# EAGLE design mainv5 (EAGLE 9.2.0)
Custom Smart 12V Battery control system.
CNAME: Caravan 12V Control System; CREVISION: 4.0; DESIGNER: Tim McConnell, M0THM

## Sheet 1 of 2
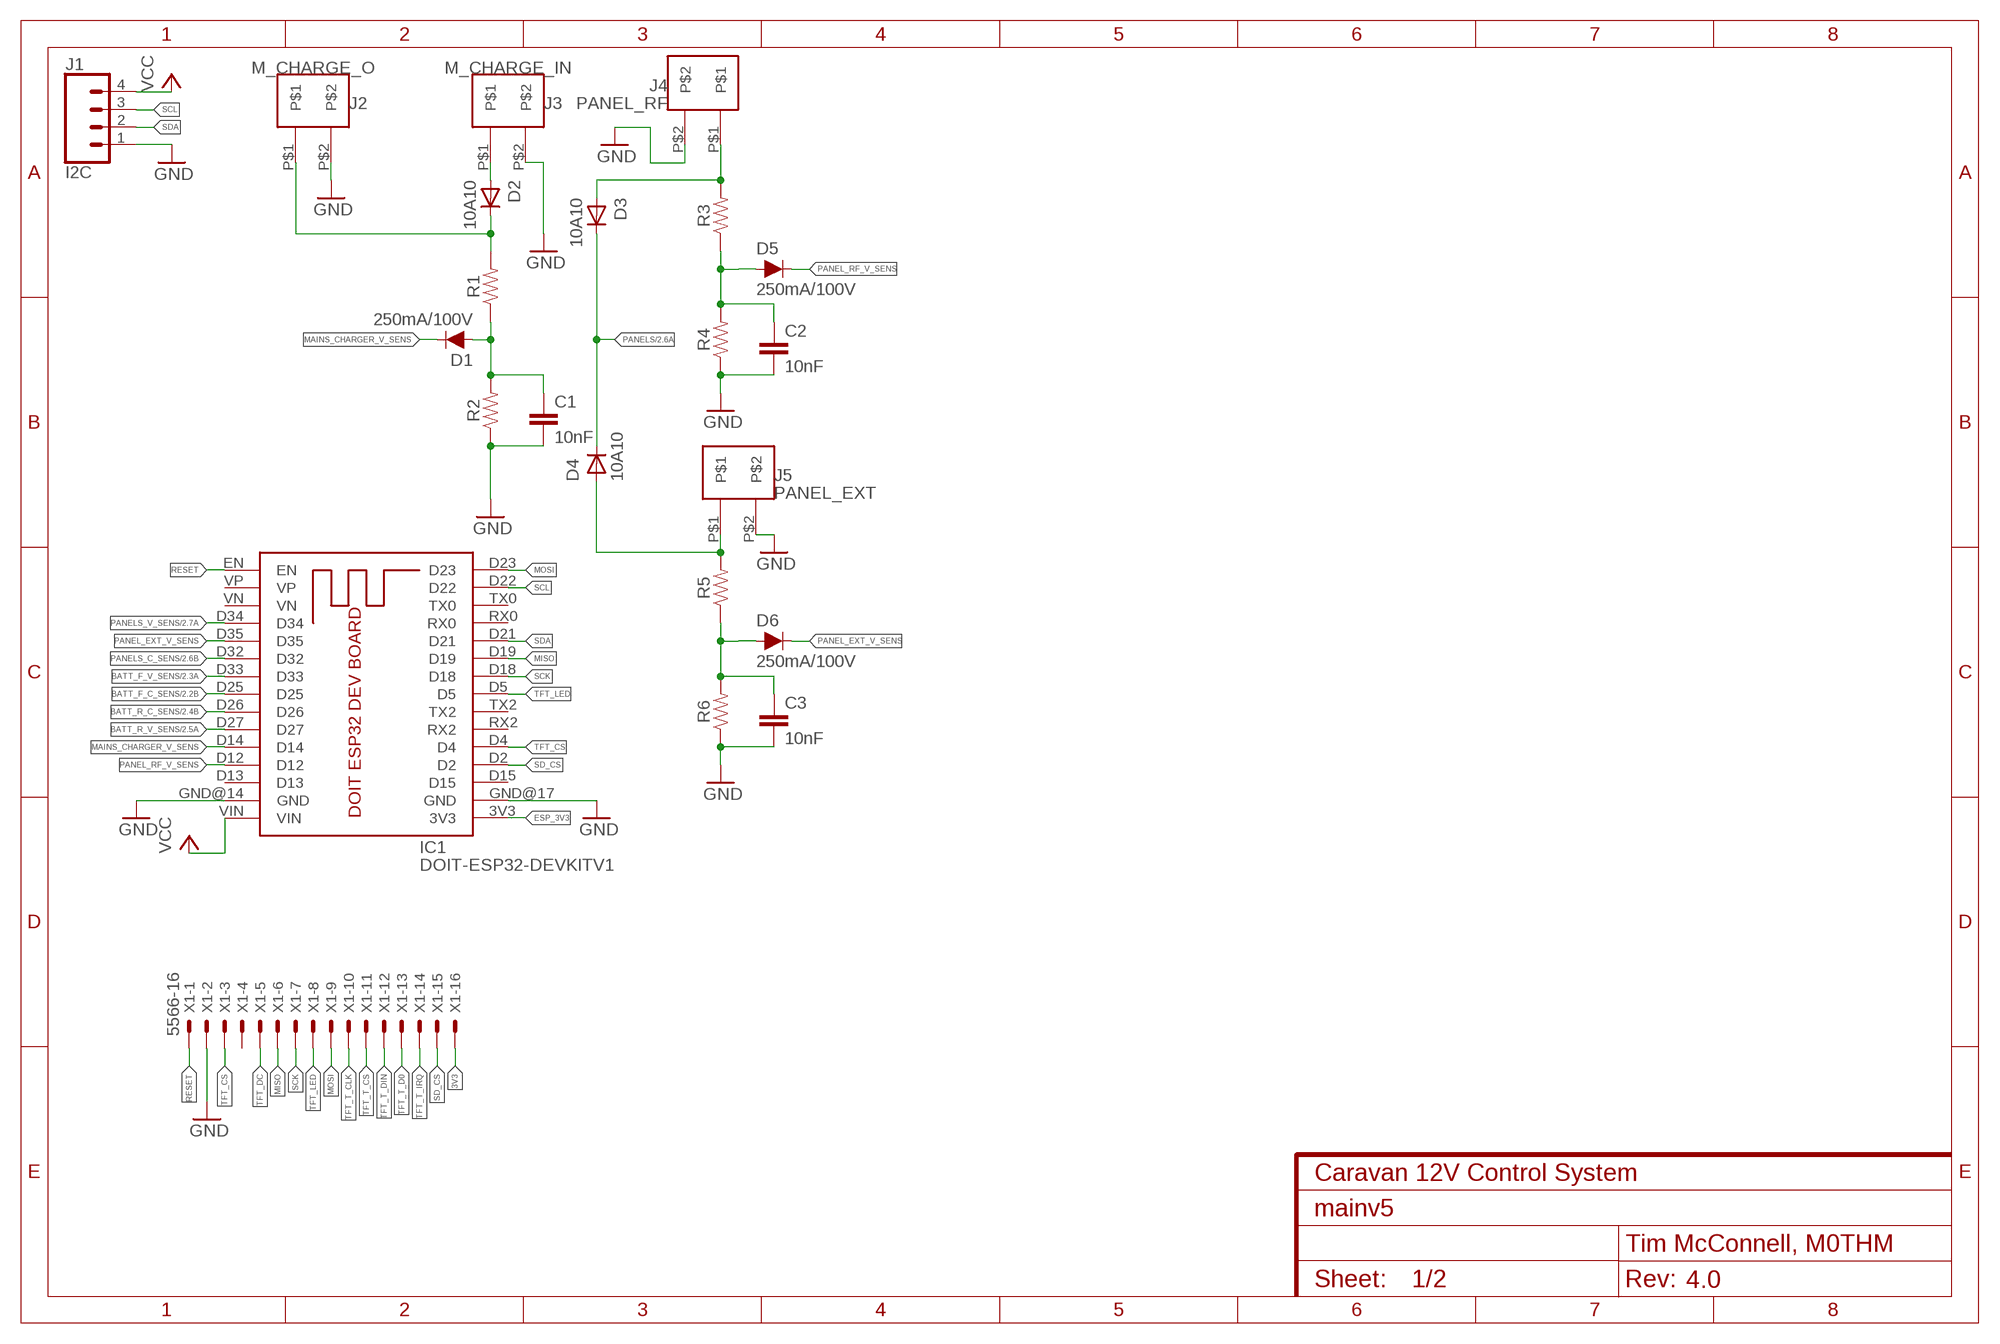
[diagram p0: schematic, sheet 1]

### Parts
C1  10nF  10NF-0603-50V-10%  [0603]
C2  10nF  10NF-0603-50V-10%  [0603]
C3  10nF  10NF-0603-50V-10%  [0603]
D1  250mA/100V  DIODE-BAS16J  [SOD-323]
D2  10A10  [AG]
D3  10A10  [AG]
D4  10A10  [AG]
D5  250mA/100V  DIODE-BAS16J  [SOD-323]
D6  250mA/100V  DIODE-BAS16J  [SOD-323]
IC1  DOIT-ESP32-DEVKITV1  [DOIT-ESP32-DEVKITV1]
J1  I2C  CONN_04POLAR  [MOLEX-1X4]
J2  M_CHARGE_O  40A-2PIN  [40A-2PIN]
J3  M_CHARGE_IN  40A-2PIN  [40A-2PIN]
J4  PANEL_RF  40A-2PIN  [40A-2PIN]
J5  PANEL_EXT  40A-2PIN  [40A-2PIN]
R1  RESISTOR0805  [0805]
R2  RESISTOR0805  [0805]
R3  RESISTOR0805  [0805]
R4  RESISTOR0805  [0805]
R5  RESISTOR0805  [0805]
R6  RESISTOR0805  [0805]
X1  5566-16  [5566-16]

### Nets
3V3: X1.16
BATT_F_C_SENS: IC1.D25 ; also sheet 2
BATT_F_V_SENS: IC1.D33 ; also sheet 2
BATT_R_C_SENS: IC1.D26 ; also sheet 2
BATT_R_V_SENS: IC1.D27 ; also sheet 2
ESP_3V3: IC1.3V3
GND: C1.2 C2.2 C3.2 IC1.GND@14(GND) IC1.GND@17(GND) J1.1 J2.P$2 J3.P$2 J4.P$2 J5.P$2 R2.1 R4.1 R6.1 X1.2 ; also sheet 2
MAINS_CHARGER_V_SENS: D1.C IC1.D14
MISO: IC1.D19 X1.6
MOSI: IC1.D23 X1.9
N$1: D2.A J3.P$1
N$2: D2.C J2.P$1 R1.2
N$13: D3.A J4.P$1 R3.2
N$14: C2.1 D5.A R3.1 R4.2
N$15: C3.1 D6.A R5.1 R6.2
N$16: D4.A J5.P$1 R5.2
N$17: C1.1 D1.A R1.1 R2.2
PANEL_EXT_V_SENS: D6.C IC1.D35
PANEL_RF_V_SENS: D5.C IC1.D12
PANELS: D3.C D4.C ; also sheet 2
PANELS_C_SENS: IC1.D32 ; also sheet 2
PANELS_V_SENS: IC1.D34 ; also sheet 2
RESET: IC1.EN X1.1
SCK: IC1.D18 X1.7
SCL: IC1.D22 J1.3
SD_CS: IC1.D2 X1.15
SDA: IC1.D21 J1.2
TFT_CS: IC1.D4 X1.3
TFT_DC: X1.5
TFT_LED: IC1.D5 X1.8
TFT_T_CLK: X1.10
TFT_T_CS: X1.11
TFT_T_D0: X1.13
TFT_T_DIN: X1.12
TFT_T_IRQ: X1.14
VCC: IC1.VIN J1.4 ; also sheet 2
Unconnected: IC1.D13 IC1.D15 IC1.RX0 IC1.RX2 IC1.TX0 IC1.TX2 IC1.VN IC1.VP X1.4

## Sheet 2 of 2
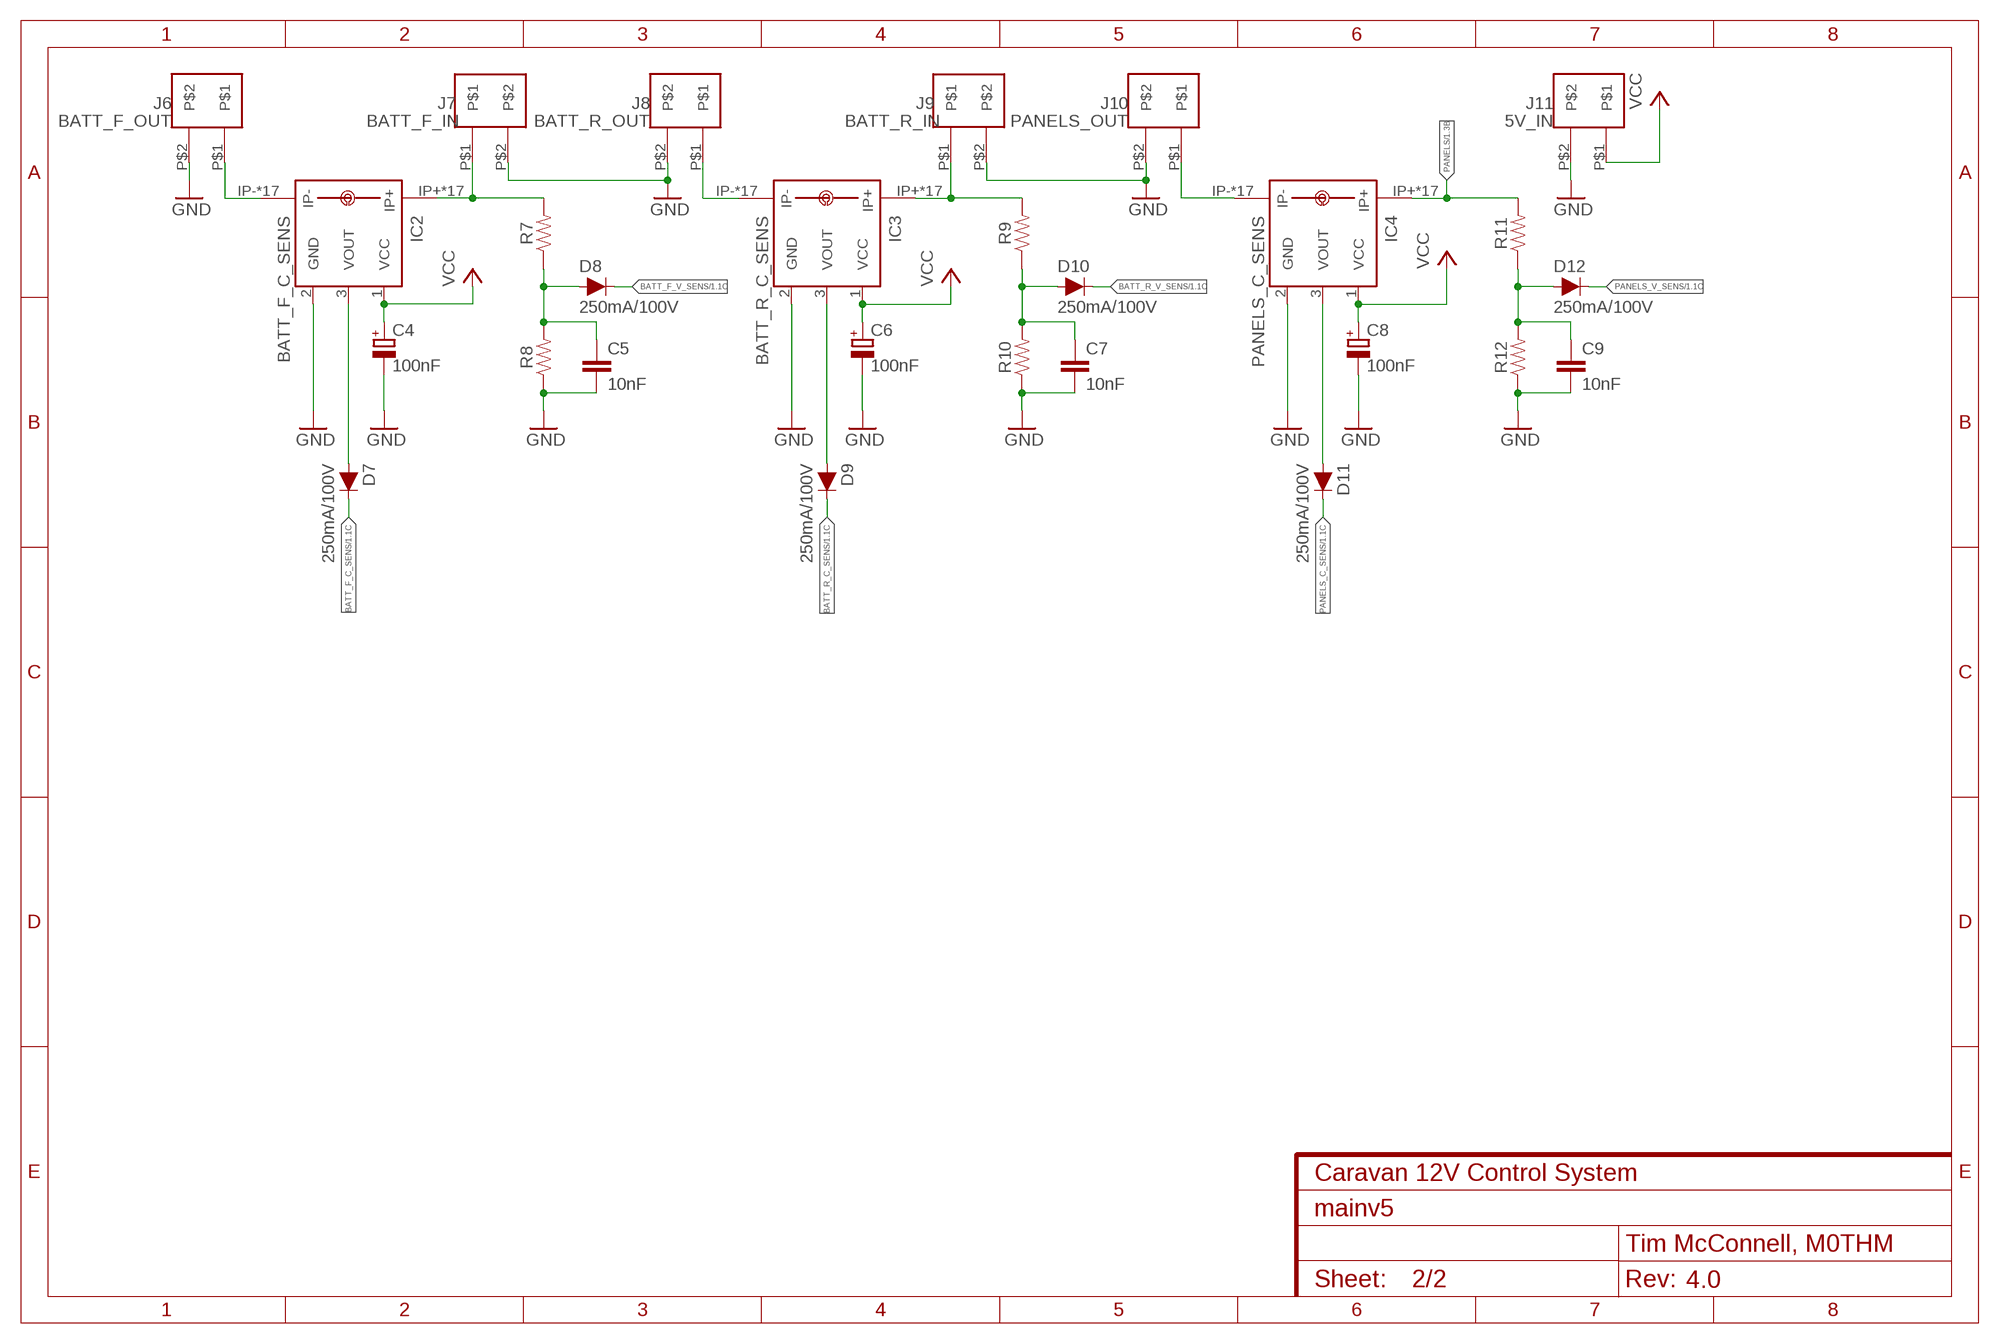
[diagram p1: schematic, sheet 2]

### Parts
C4  100nF  CPOL-EUE  [PANASONIC_E]
C5  10nF  10NF-0603-50V-10%  [0603]
C6  100nF  CPOL-EUE  [PANASONIC_E]
C7  10nF  10NF-0603-50V-10%  [0603]
C8  100nF  CPOL-EUE  [PANASONIC_E]
C9  10nF  10NF-0603-50V-10%  [0603]
D7  250mA/100V  DIODE-BAS16J  [SOD-323]
D8  250mA/100V  DIODE-BAS16J  [SOD-323]
D9  250mA/100V  DIODE-BAS16J  [SOD-323]
D10  250mA/100V  DIODE-BAS16J  [SOD-323]
D11  250mA/100V  DIODE-BAS16J  [SOD-323]
D12  250mA/100V  DIODE-BAS16J  [SOD-323]
IC2  BATT_F_C_SENS  ACS758ECB-200B-PFF-T  [CB-PFF]
IC3  BATT_R_C_SENS  ACS758ECB-200B-PFF-T  [CB-PFF]
IC4  PANELS_C_SENS  ACS758ECB-200B-PFF-T  [CB-PFF]
J6  BATT_F_OUT  40A-2PIN  [40A-2PIN]
J7  BATT_F_IN  40A-2PIN  [40A-2PIN]
J8  BATT_R_OUT  40A-2PIN  [40A-2PIN]
J9  BATT_R_IN  40A-2PIN  [40A-2PIN]
J10  PANELS_OUT  40A-2PIN  [40A-2PIN]
J11  5V_IN  40A-2PIN  [40A-2PIN]
R7  RESISTOR0805  [0805]
R8  RESISTOR0805  [0805]
R9  RESISTOR0805  [0805]
R10  RESISTOR0805  [0805]
R11  RESISTOR0805  [0805]
R12  RESISTOR0805  [0805]

### Nets
BATT_F_C_SENS: D7.C ; also sheet 1
BATT_F_V_SENS: D8.C ; also sheet 1
BATT_R_C_SENS: D9.C ; also sheet 1
BATT_R_V_SENS: D10.C ; also sheet 1
GND: C4.- C5.2 C6.- C7.2 C8.- C9.2 IC2.2(GND) IC3.2(GND) IC4.2(GND) J6.P$2 J7.P$2 J8.P$2 J9.P$2 J10.P$2 J11.P$2 R8.1 R10.1 R12.1 ; also sheet 1
N$3: IC2.IP- IC2.IP-@2(IP-) IC2.IP-@3(IP-) IC2.IP-@4(IP-) IC2.IP-@5(IP-) IC2.IP-@6(IP-) IC2.IP-@7(IP-) IC2.IP-@8(IP-) IC2.IP-@9(IP-) IC2.IP-@10(IP-) IC2.IP-@11(IP-) IC2.IP-@12(IP-) IC2.IP-@13(IP-) IC2.IP-@14(IP-) IC2.IP-@15(IP-) IC2.IP-@16(IP-) IC2.IP-@17(IP-) J6.P$1
N$11: D7.A IC2.3(VOUT)
N$20: IC2.IP+ IC2.IP+@2(IP+) IC2.IP+@3(IP+) IC2.IP+@4(IP+) IC2.IP+@5(IP+) IC2.IP+@6(IP+) IC2.IP+@7(IP+) IC2.IP+@8(IP+) IC2.IP+@9(IP+) IC2.IP+@10(IP+) IC2.IP+@11(IP+) IC2.IP+@12(IP+) IC2.IP+@13(IP+) IC2.IP+@14(IP+) IC2.IP+@15(IP+) IC2.IP+@16(IP+) IC2.IP+@17(IP+) J7.P$1 R7.2
N$21: C5.1 D8.A R7.1 R8.2
N$22: D9.A IC3.3(VOUT)
N$23: IC3.IP- IC3.IP-@2(IP-) IC3.IP-@3(IP-) IC3.IP-@4(IP-) IC3.IP-@5(IP-) IC3.IP-@6(IP-) IC3.IP-@7(IP-) IC3.IP-@8(IP-) IC3.IP-@9(IP-) IC3.IP-@10(IP-) IC3.IP-@11(IP-) IC3.IP-@12(IP-) IC3.IP-@13(IP-) IC3.IP-@14(IP-) IC3.IP-@15(IP-) IC3.IP-@16(IP-) IC3.IP-@17(IP-) J8.P$1
N$24: IC3.IP+ IC3.IP+@2(IP+) IC3.IP+@3(IP+) IC3.IP+@4(IP+) IC3.IP+@5(IP+) IC3.IP+@6(IP+) IC3.IP+@7(IP+) IC3.IP+@8(IP+) IC3.IP+@9(IP+) IC3.IP+@10(IP+) IC3.IP+@11(IP+) IC3.IP+@12(IP+) IC3.IP+@13(IP+) IC3.IP+@14(IP+) IC3.IP+@15(IP+) IC3.IP+@16(IP+) IC3.IP+@17(IP+) J9.P$1 R9.2
N$25: C7.1 D10.A R9.1 R10.2
N$26: D11.A IC4.3(VOUT)
N$27: IC4.IP- IC4.IP-@2(IP-) IC4.IP-@3(IP-) IC4.IP-@4(IP-) IC4.IP-@5(IP-) IC4.IP-@6(IP-) IC4.IP-@7(IP-) IC4.IP-@8(IP-) IC4.IP-@9(IP-) IC4.IP-@10(IP-) IC4.IP-@11(IP-) IC4.IP-@12(IP-) IC4.IP-@13(IP-) IC4.IP-@14(IP-) IC4.IP-@15(IP-) IC4.IP-@16(IP-) IC4.IP-@17(IP-) J10.P$1
N$28: C9.1 D12.A R11.1 R12.2
PANELS: IC4.IP+ IC4.IP+@2(IP+) IC4.IP+@3(IP+) IC4.IP+@4(IP+) IC4.IP+@5(IP+) IC4.IP+@6(IP+) IC4.IP+@7(IP+) IC4.IP+@8(IP+) IC4.IP+@9(IP+) IC4.IP+@10(IP+) IC4.IP+@11(IP+) IC4.IP+@12(IP+) IC4.IP+@13(IP+) IC4.IP+@14(IP+) IC4.IP+@15(IP+) IC4.IP+@16(IP+) IC4.IP+@17(IP+) R11.2 ; also sheet 1
PANELS_C_SENS: D11.C ; also sheet 1
PANELS_V_SENS: D12.C ; also sheet 1
VCC: C4.+ C6.+ C8.+ IC2.1(VCC) IC3.1(VCC) IC4.1(VCC) J11.P$1 ; also sheet 1

## Library data of the parts
C1-C3 C5 C7 C9 = SparkFun-Capacitors:10NF: 0.01uF/10nF/10,000pF ceramic capacitors A capacitor is a passive two-terminal electrical component used to store electrical energy temporarily in an electric field. CAP-09321; PROD_ID: CAP-00867
C4 C6 C8 = rcl:CPOL-EU: POLARIZED CAPACITOR, European symbol; SPICEPREFIX: C
D1 D5-D12 = SparkFun-DiscreteSemi:DIODE: Diode These are standard reverse protection diodes and small signal diodes. SparkFun Products: SparkFun SparkPunk Sound Kit <https://www.sparkfun.com/products/11177> SparkFun ESP8266 Thing <https://www.sparkfun.com/products/13231>; PROD_ID: DIO-09646
D2-D4 = m0thm:10A10
IC1 = m0thm:DOIT-ESP32-DEVKITV1: https://docs.zerynth.com/latest/official/board.zerynth.doit_esp32/docs/index.html
IC2-IC4 = allegro-2:ACS758*: Thermally Enhanced, Fully Integrated, Hall Effect-Based Linear Current Sensor with 100 micro Ohm Current Conductor display layer 49 Reference in BRD and place VIAs on circles Source: http://www.allegromicro.com/en/Products/Part_Numbers/0758/0758.pdf; MPN: ACS758ECB-200B-PFF-T; OC_FARNELL: 1718993; OC_NEWARK: 04R7127
J1 = SparkFun-Connectors:CONN_04: Multi connection point. Often used as Generic Header-pin footprint for 0.1 inch spaced/style header connections On any of the 0.1 inch spaced packages, you can populate with these: Break Away Headers - Straight <https://www.sparkfun.com/products/116> (PRT-00116) Break Away Male Headers - Right Angle <https://www.sparkfun.com/products/553> (PRT-00553) Female Headers <https://www.sparkfun.com/products/115> (PRT-00115) Break Away Headers - Machine Pin <https://www.sparkfun.com/products/117> (PRT-00117) Break Away Female Headers - Swiss Machine Pin <https://www.sparkfun.com/products/743> (PRT-00743) For SCREWTERMINALS and SPRING TERMINALS visit here: Screw Terimnals on SparkFun.com <https://www.sparkfun.com/search/results?term=Screw+Terminals> (5mm/3.5mm/2.54mm spacing) This device is also useful as a general connection point to wire up your design to another part of your project. Our various solder wires solder well into these plated through hole pads. Hook-Up Wire - Assortment (Stranded, 22 AWG) <https://www.sparkfun.com/products/11375> (PRT-11375) Hook-Up Wire - Assortment (Solid Core, 22 AWG) <https://www.sparkfun.com/products/11367> (PRT-11367) View the entire wire category on our website here <https://www.sparkfun.com/categories/141> Special notes: Molex polarized connector foot print use with SKU : PRT-08231 with associated crimp pins and housings. 1MM SMD Version SKU: PRT-10208; PROD_ID: CONN-08186; SF_ID: PRT-08231
J2-J11 = m0thm:40A-2PIN
R1-R12 = SparkFun-Resistors:RESISTOR: Generic Resistor Package
X1 = con-molex:5566-16: Mini FIT connector 16 pol Source: http://www.molex.com; MF: MOLEX; OC_FARNELL: unknown; OC_NEWARK: unknown

## Board
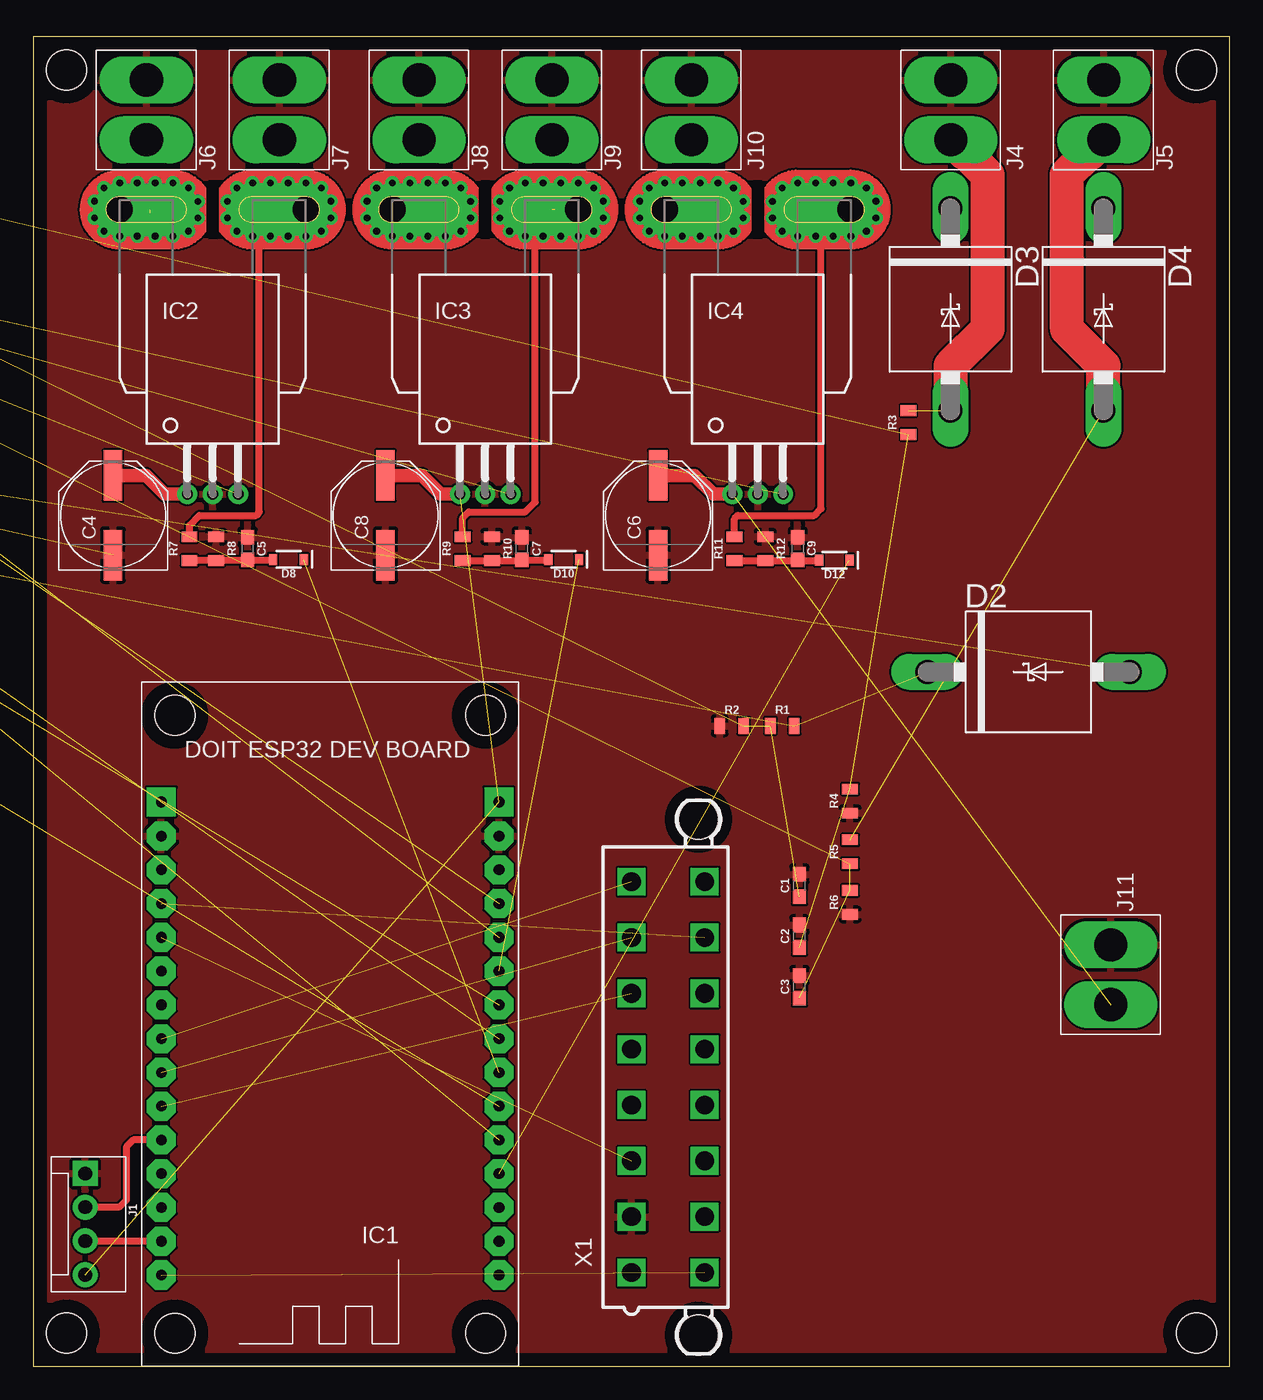
[diagram p2: board, top side]
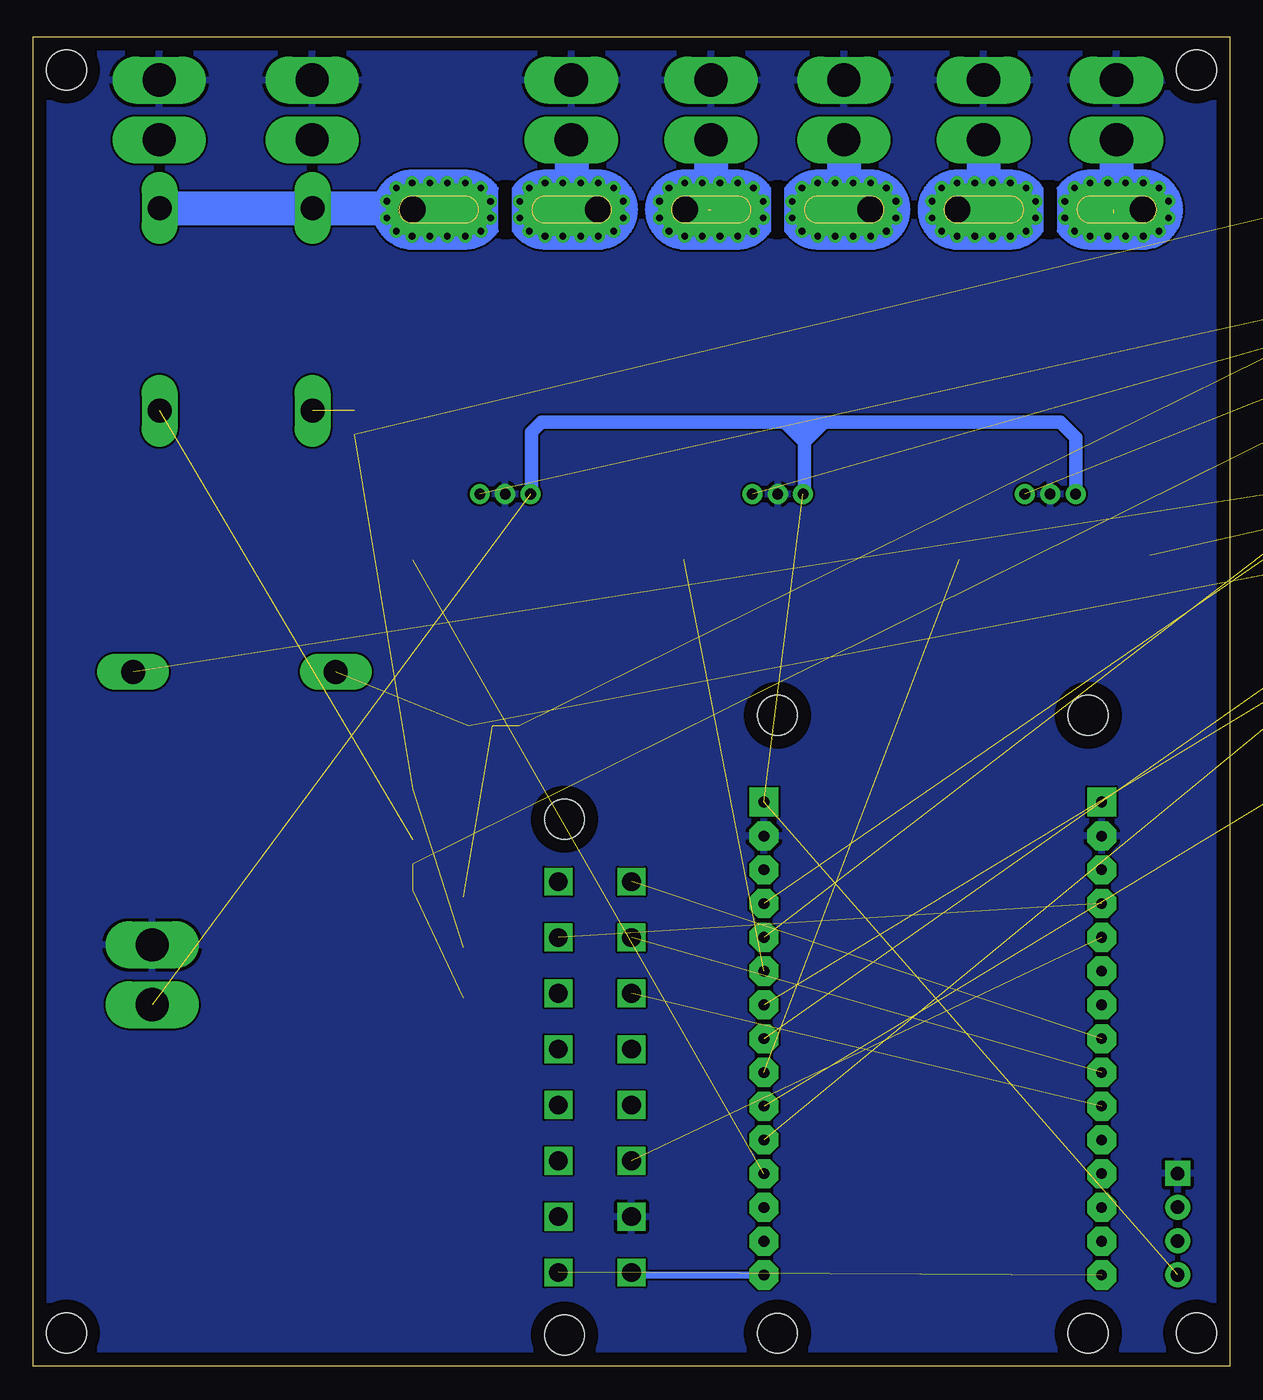
[diagram p3: board, bottom side, seen from below]

Size 90 x 100 mm. Coordinates in mm from the lower left corner, seen from the top.
Outline: 0,0 90,0 90,100 0,100 0,0
Copper layers (1*16): Top 0.035mm / dielectric 1.5mm / Bottom 0.035mm
Design rules "default": minimum track width 6mil, minimum drill 0.35mm, track to track 6mil, track to pad 6mil, pad to pad 6mil, via to via 6mil, smd to smd 6mil, copper to edge 40mil, drill to drill 6mil, minimum pad ring 10mil, minimum via ring 8mil, stop-mask expansion 4mil, vias tented up to drill 0mil, thermal gap 10mil
Holes 3 mm at 2.5,2.5 87.5,2.5 87.5,97.5 2.5,97.5

### Footprints (pad centres in the part's own frame; a part is rotated, then mirrored left to right if it is on the bottom)
0603 = smd 1.1 x 1: 1 -0.85,0; 2 0.85,0
PANASONIC_E = smd 3.8 x 1.4: + 3,0; - -3,0
SOD-323 = smd 0.63 x 0.83: A 1.15,0; C -1.15,0
AG = drill 1.803 long: A 7.62,0; C -7.62,0
DOIT-ESP32-DEVKITV1 = drill 0.8 pad 2.184 square: 3V3 42.45,26.865; VIN 42.45,1.465 | drill 0.8 pad 2.184 octagon: D2 34.8,26.865; D4 32.26,26.865; D5 24.64,26.865; D12 34.8,1.465; D13 37.34,1.465; D14 32.26,1.465; D15 37.34,26.865; D18 22.1,26.865; D19 19.56,26.865; D21 17.02,26.865; D22 9.4,26.865; D23 6.86,26.865; D25 24.64,1.465; D26 27.18,1.465; D27 29.72,1.465; D32 19.56,1.465; D33 22.1,1.465; D34 14.48,1.465; D35 17.02,1.465; EN 6.86,1.465; GND@14 39.88,1.465; GND@17 39.88,26.865; RX0 14.48,26.865; RX2 29.72,26.865; TX0 11.94,26.865; TX2 27.18,26.865; VN 11.94,1.465; VP 9.4,1.465 | hole 3: 2.48,25.85; 2.48,2.48; 48.97,2.48; 48.97,25.85
CB-PFF = drill 0.8 pad 1.5: 1 -1.91,-21.4; 2 0,-21.4; 3 1.91,-21.4 | drill 2 pad 4 offset: IP+ 7,0; IP- -7,0 | drill 0.5 pad 0.9: IP+@2 8.89,0.635; IP+@3 8.89,-0.635; IP+@4 8.175,-1.625; IP+@5 7,-2; IP+@6 5.675,-2; IP+@7 4.35,-2; IP+@8 3,-2; IP+@9 1.825,-1.625; IP+@10 1.1,-0.625; IP+@11 1.1,0.625; IP+@12 1.825,1.625; IP+@13 3,2; IP+@14 4.35,2; IP+@15 5.675,2; IP+@16 7,2; IP+@17 8.175,1.625; IP-@2 -8.89,0.635; IP-@3 -8.89,-0.635; IP-@4 -8.175,-1.625; IP-@5 -7,-2; IP-@6 -5.675,-2; IP-@7 -4.325,-2; IP-@8 -3,-2; IP-@9 -1.825,-1.625; IP-@10 -1.1,-0.625; IP-@11 -1.1,0.625; IP-@12 -1.825,1.625; IP-@13 -3,2; IP-@14 -4.325,2; IP-@15 -5.675,2; IP-@16 -7,2; IP-@17 -8.175,1.625
MOLEX-1X4 = drill 1.016 pad 1.88 square: 1 0,0 | drill 1.016 pad 1.88: 2 2.54,0; 3 5.08,0; 4 7.62,0
40A-2PIN = drill 2.5 long: P$1 -2.25,-0.02; P$2 2.25,-0.02
0805 = smd 0.8 x 1.2: 1 -0.9,0; 2 0.9,0
5566-16 = drill 1.4 square: 1 14.7,-2.75; 2 10.5,-2.75; 3 6.3,-2.75; 4 2.1,-2.75; 5 -2.1,-2.75; 6 -6.3,-2.75; 7 -10.5,-2.75; 8 -14.7,-2.75; 9 14.7,2.75; 10 10.5,2.75; 11 6.3,2.75; 12 2.1,2.75; 13 -2.1,2.75; 14 -6.3,2.75; 15 -10.5,2.75; 16 -14.7,2.75 | hole 3: 19.4,2.29; -19.4,2.29

### Placement (x,y rotation side)
C1  57.63,36.16 90 top
C2  57.63,32.35 90 top
C3  57.63,28.54 90 top
C4  6,64 90 top
C5  16.13,61.5 90 top
C6  47,64 90 top
C7  36.75,61.5 90 top
C8  26.5,64 90 top
C9  57.5,61.5 90 top
D1  -50.8,99.06 0 top  (outside the outline)
D2  74.87,52.23 0 top
D3  69,79.5 270 top
D4  80.5,79.5 270 top
D5  -57.15,99.06 0 top  (outside the outline)
D6  -63.5,99.06 0 top  (outside the outline)
D7  -69.85,99.06 0 top  (outside the outline)
D8  19.2,60.69 180 top
D9  -82.55,99.06 0 top  (outside the outline)
D10  39.9,60.69 180 top
D11  -95.25,99.06 0 top  (outside the outline)
D12  60.26,60.63 180 top
IC1  36.5,0 90 top
IC2  13.5,87 0 top
IC3  34,87 0 top
IC4  54.5,87 0 top
J1  3.91,14.5 270 top
J2  -74.93,73.66 0 top  (outside the outline)
J3  -52.07,73.66 0 top  (outside the outline)
J4  69,94.5 90 top
J5  80.5,94.5 90 top
J6  8.5,94.5 90 top
J7  18.5,94.5 90 top
J8  29,94.5 90 top
J9  39,94.5 90 top
J10  49.5,94.5 90 top
J11  81.04,29.45 90 top
R1  56.35,48.17 0 top
R2  52.54,48.17 0 top
R3  65.83,70.98 90 top
R4  61.44,42.51 90 top
R5  61.44,38.7 90 top
R6  61.44,34.89 90 top
R7  11.75,61.5 90 top
R8  13.75,61.5 270 top
R9  32.3,61.5 90 top
R10  34.5,61.5 270 top
R11  52.75,61.5 90 top
R12  55.06,61.5 270 top
X1  47.75,21.75 270 top

### Tracks (layer width: path | path; a pad name or v marks a point on that pad's centre or on a via)
BATT_F_C_SENS  (1 unrouted)
BATT_F_V_SENS  (1 unrouted)
BATT_R_C_SENS  (1 unrouted)
BATT_R_V_SENS  (1 unrouted)
GND  (2 unrouted)
  pour Top: 0,0 0,100 90,100 90,0
  pour Bottom: 0,0 0,100 90,100 90,0
MAINS_CHARGER_V_SENS  (1 unrouted)
MISO  (1 unrouted)
MOSI  (1 unrouted)
N$1  (1 unrouted)
N$2  (2 unrouted)
N$3  (1 unrouted)
  Top 2.54: 8.52,87.23 8.75,87 IC2.IP-
  Bottom 2.54: 8.75,86.75 9.25,87.25 8.52,87.98 J6.P$1 | 6,86.5 7.75,86.5 8.52,87.27 | 5.5,86.5 6,86.5 | IC2.IP- 6,86.5
N$11  (1 unrouted)
N$13  (1 unrouted)
  Top 2.54: J4.P$1 70.02,91.25 70.15,91.25 71.78,89.62 71.78,78.03 69,75.25 D3.A
N$14  (3 unrouted)
N$15  (3 unrouted)
N$16  (1 unrouted)
  Top 2.54: J5.P$1 79.52,91.25 79.35,91.25 77.72,89.62 77.72,83.28 77.75,83.25 77.75,78 80.5,75.25 D4.A
N$17  (3 unrouted)
N$20
  Top 0.508: R7.2 11.75,63.25 12.5,64 16.75,64 17,64.25 17,86 16.75,86.25 17.5,87 18.75,87
  Top 2.54: 18.52,87.23 18.75,87 IC2.IP+
  Bottom 2.54: J7.P$1 18.52,86.98 18.75,86.75 19,87 IC2.IP+
N$21
  Top 0.508: R7.1 R8.2 16.08,60.6 C5.1 18.01,60.65 D8.A
N$22  (1 unrouted)
N$23
  Top 2.54: 29.02,86.73 29.25,86.5 27.5,86.5 IC3.IP-
  Bottom 2.54: J8.P$1 29.02,87.48 29.5,87 IC3.IP-
N$24  (1 unrouted)
  Top 0.508: R9.2 32.3,63.8 32.75,64.25 37,64.25 37.75,65 37.75,87 39.25,87
  Top 2.54: 38.31,86.94 38.75,86.5 39.25,87 IC3.IP+
  Bottom 2.54: 39.5,87 39.25,86.75 39.02,86.98 J9.P$1
N$25
  Top 0.508: R9.1 R10.2 36.7,60.6 C7.1 38.71,60.65 D10.A
N$26  (1 unrouted)
N$27
  Bottom 2.54: J10.P$1 49.52,87.27 49.5,87.25 49.75,87 | 49.75,87 51.75,87 | 49.75,87 IC4.IP-
N$28
  Top 0.508: R11.1 R12.2 57.45,60.6 | 57.45,60.6 C9.1 | 57.45,60.6 59.08,60.6 D12.A
PANEL_EXT_V_SENS  (1 unrouted)
PANEL_RF_V_SENS  (1 unrouted)
PANELS
  Top 0.508: R11.2 52.75,63.75 53,64 58.75,64 59.25,64.5 59.25,86 59,86.25 59.75,87 IC4.IP+
  Bottom 2.54: D4.C D3.C 58.88,87.12 | 58.88,87.12 58.75,87.25 | 58.88,87.12 59,87 IC4.IP+
PANELS_C_SENS  (1 unrouted)
PANELS_V_SENS  (1 unrouted)
RESET
  Bottom 0.508: IC1.EN 45,6.86 X1.1
SCK  (1 unrouted)
SCL
  Top 0.508: IC1.D22 3.93,9.4 J1.3
SD_CS  (1 unrouted)
SDA
  Top 0.508: J1.2 6.46,11.96 7,12.5 7,16.5 7.52,17.02 IC1.D21
TFT_CS  (1 unrouted)
TFT_LED  (1 unrouted)
VCC  (3 unrouted)
  Top 1.016: IC2.1 9.9,65.6 8.5,67 C4.+ | IC3.1 30.65,65.6 29.25,67 C8.+ | IC4.1 51.15,65.6 49.75,67 C6.+
  Bottom 1.016: IC2.1 11.59,69.84 12.75,71 30.75,71 | IC4.1 52.5,65.69 52.5,70.25 51.75,71 33.5,71 | 30.75,71 32,71 | 32,71 33.5,71 | IC3.1 32,65.69 32,69.5 | 32,69.5 32,71 | 33.5,71 32,69.5 | 32,69.5 30.75,70.75 30.75,71